# Altium schematic sheet DC_Jack_uUSB.SchDoc (part 1 of 3)
size A2; SheetNumber: 1; SheetTotal: 1
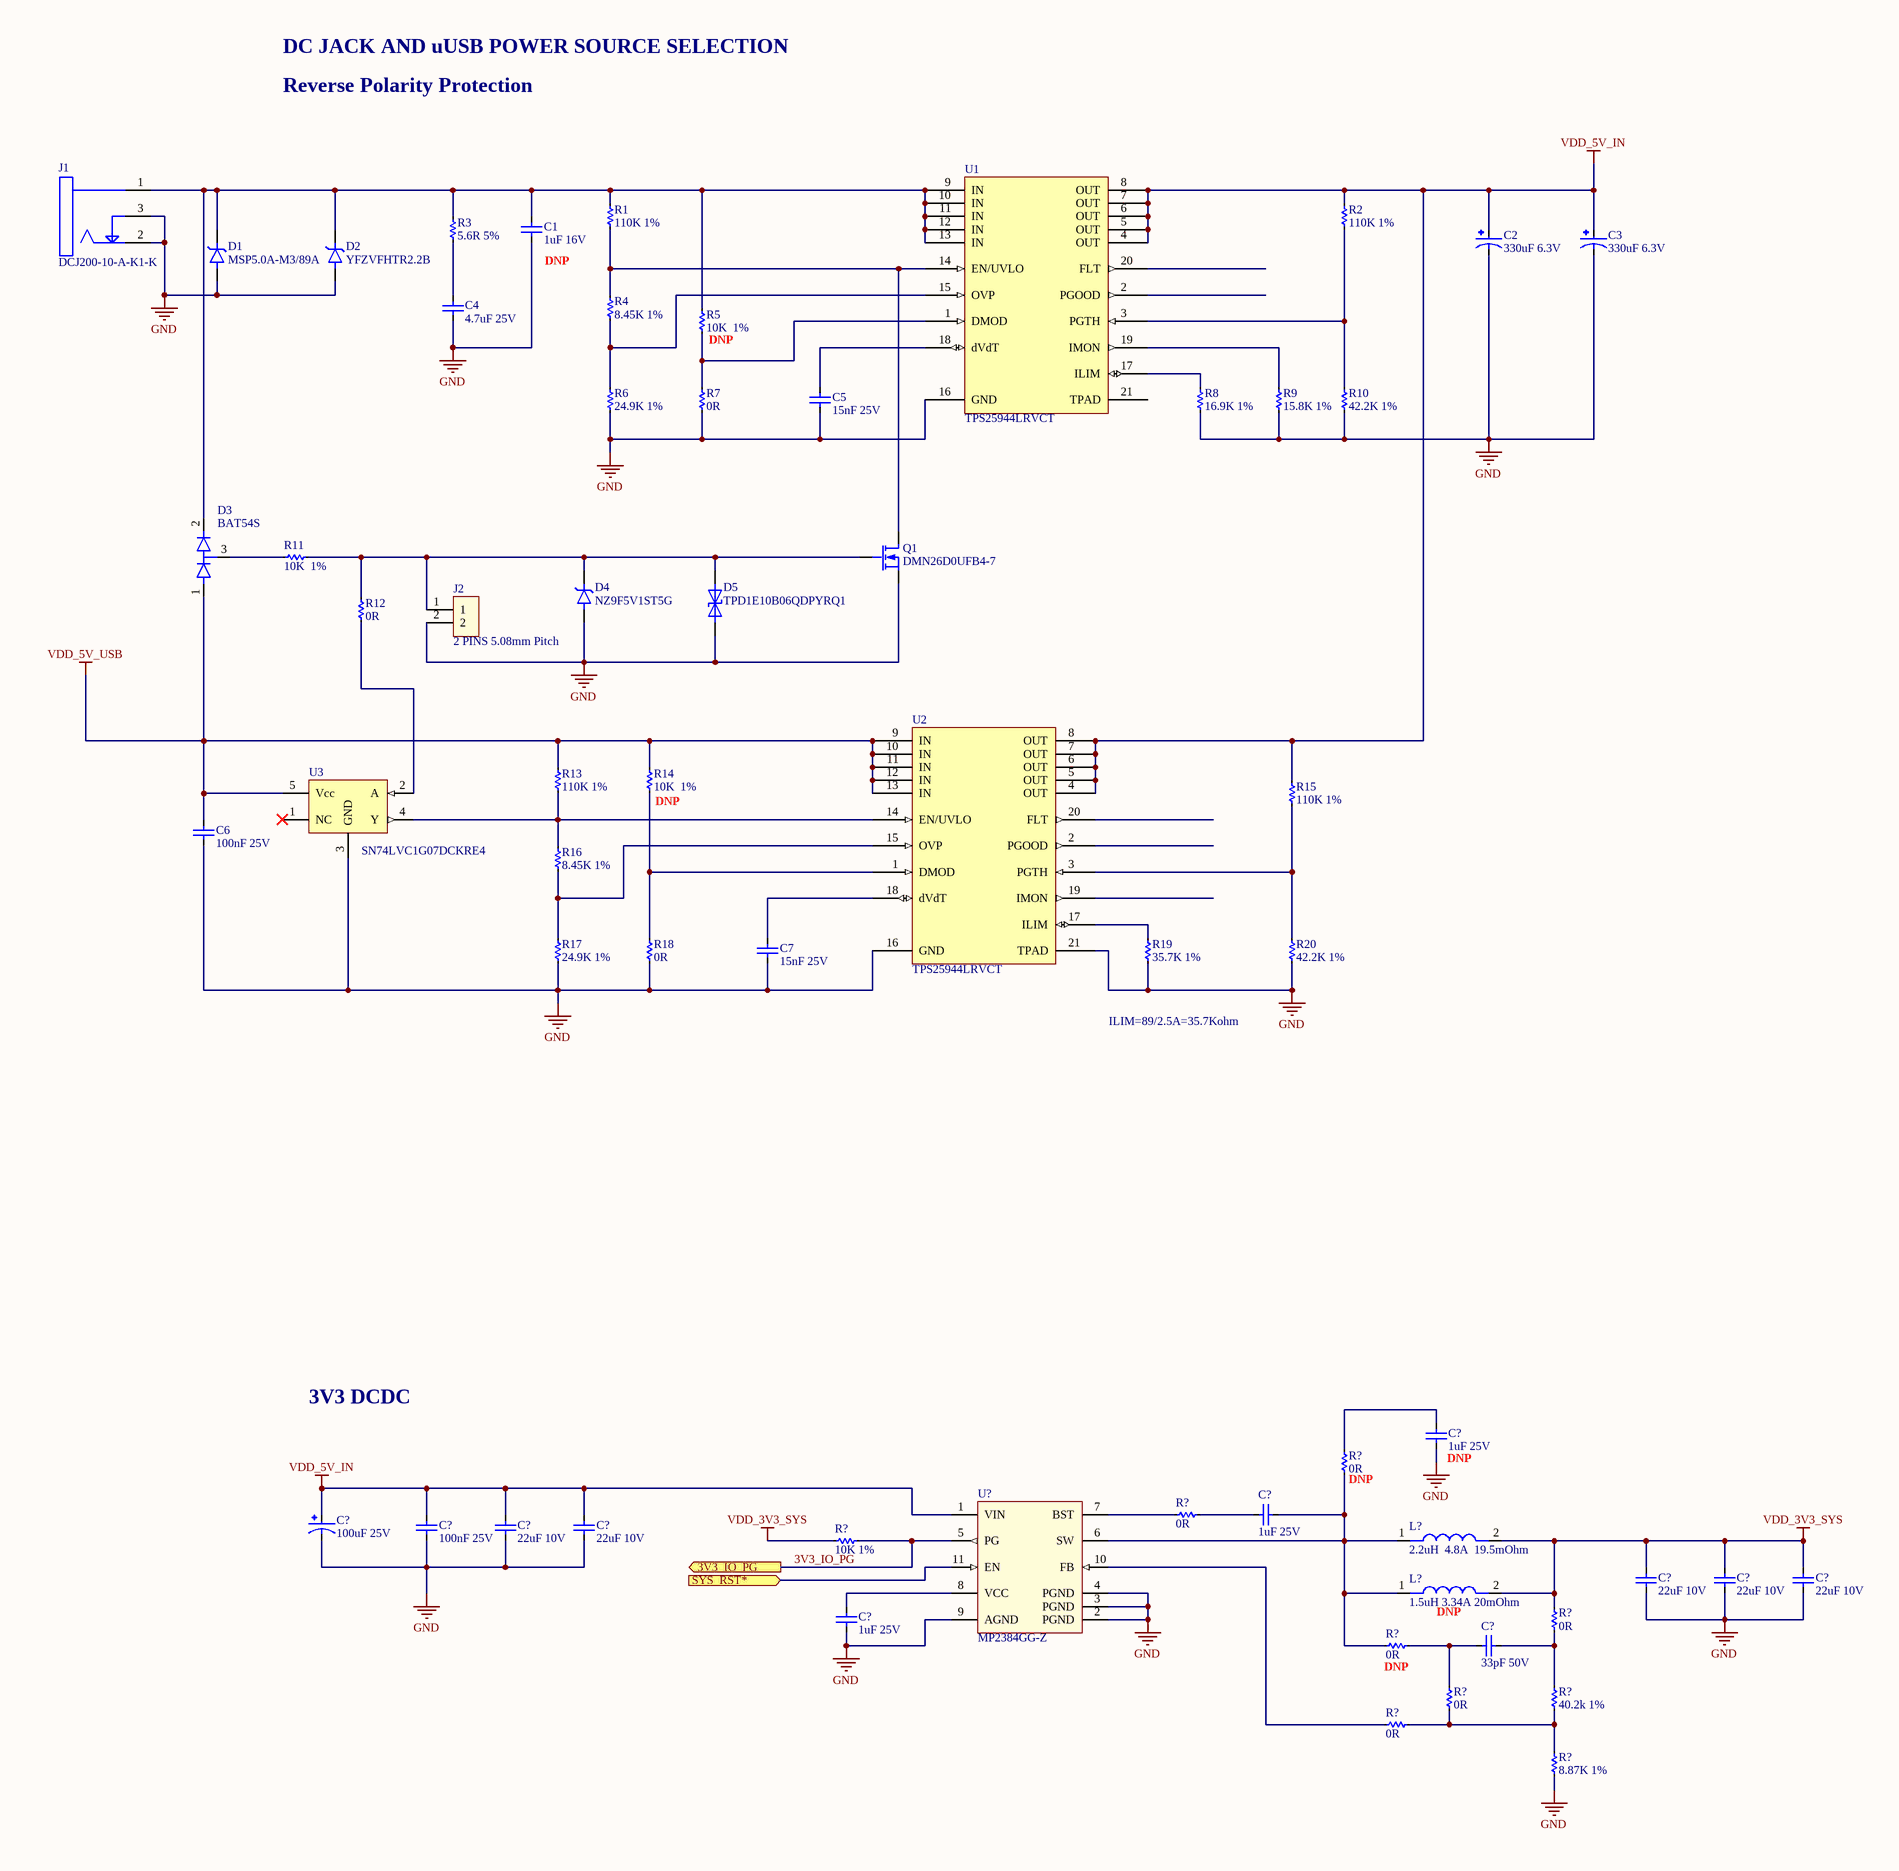
[diagram p0: DC_Jack_uUSB.SchDoc, left]
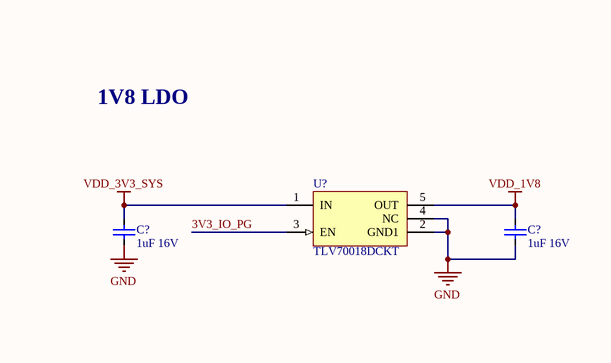
[diagram p1: DC_Jack_uUSB.SchDoc, right]

## Parts
(Parts that share a designator on the sheet are numbered #1, #2 ... from top to bottom, then left to right.)
C1  1uF 16V  [C0603]
C2  330uF 6.3V  [CP_ELEC_6.3x7.7]
C3  330uF 6.3V  [CP_ELEC_6.3x7.7]
C4  4.7uF 25V  [C0603]
C5  15nF 25V  [C0805]
C6  100nF 25V  [C0402]
C7  15nF 25V  [C0805]
C?#1  1uF 16V  [C0603]
C?#2  1uF 16V  [C0603]
C?#3  1uF 25V  [C0603]
C?#4  1uF 25V  [C0603]
C?#5  100uF 25V  [C2917_Tantalum]
C?#6  100nF 25V  [C0402]
C?#7  22uF 10V  [C0805]
C?#8  22uF 10V  [C0805]
C?#9  22uF 10V  [C0805]
C?#10  22uF 10V  [C0805]
C?#11  22uF 10V  [C0805]
C?#12  1uF 25V  [C0603]
C?#13  33pF 50V  [C0402]
D1  MSP5.0A-M3/89A  [DO-219AD]
D2  YFZVFHTR2.2B  [YFZVFHTR22B]
D3  BAT54S  [SOT23_M]
D4  NZ9F5V1ST5G  [SOD-923]
D5  TPD1E10B06QDPYRQ1  [2-X1SON (1x.60)]
J1  DCJ200-10-A-K1-K  [DCJ200-10-A-K1-K]
J2  2 PINS 5.08mm Pitch  [0395443002]
L?#1  2.2uH  4.8A  19.5mOhm  [NRS8030T2R2NJGJ]
L?#2  1.5uH 3.34A 20mOhm  [ASPI-4030S-1R5N-T]
Q1  DMN26D0UFB4-7  [DFN1006-3]
R1  110K 1%  [R0402]
R2  110K 1%  [R0402]
R3  5.6R 5%  [R0402]
R4  8.45K 1%  [R0402]
R5  10K  1%  [R0402]
R6  24.9K 1%  [R0402]
R7  0R  [R0603]
R8  16.9K 1%  [R0402]
R9  15.8K 1%  [R0603]
R10  42.2K 1%  [R0402]
R11  10K  1%  [R0402]
R12  0R  [R0603]
R13  110K 1%  [R0402]
R14  10K  1%  [R0402]
R15  110K 1%  [R0402]
R16  8.45K 1%  [R0402]
R17  24.9K 1%  [R0402]
R18  0R  [R0603]
R19  35.7K 1%  [R0402]
R20  42.2K 1%  [R0402]
R?#1  0R  [R0603]
R?#2  0R  [R0603]
R?#3  10K 1%  [R0603]
R?#4  0R  [R0603]
R?#5  0R  [R0603]
R?#6  0R  [R0603]
R?#7  40.2k 1%  [R0402]
R?#8  0R  [R0603]
R?#9  8.87K 1%  [R0402]
U1  TPS25944LRVCT  [WQFN (3x4)-20]
U2  TPS25944LRVCT  [WQFN (3x4)-20]
U3  SN74LVC1G07DCKRE4  [SC70-5]
U?#1  TLV70018DCKT  [SC70-5]
U?#2  MP2384GG-Z  [QFN(2X2)-11]

## Ports
3V3_IO_PG (out), SYS_RST* (in)

## Nets
GND: C1.1 C2.2(-) C3.2(-) C4.1 C5.1 C6.1 C7.1 C?#1.1 C?#2.1 C?#3.2 C?#5.2(-) C?#6.2 C?#7.1 C?#8.1 C?#9.1 C?#10.1 C?#11.1 C?#12.1 D1.1(A) D2.2(A) D4.2(A) D5.1 J1.2 J1.3 J2.2 Q1.2(S) R6.1 R7.1 R8.1 R9.1 R10.1 R17.1 R18.1 R19.1 R20.1 R?#9.1 U1.16(GND) U2.16(GND) U2.21(TPAD) U3.3(GND) U?#1.2(GND1) U?#1.4(NC) U?#2.2(PGND) U?#2.3(PGND) U?#2.4(PGND) U?#2.9(AGND)
VDD_1V8: C?#2.2 U?#1.5(OUT)
VDD_3V3_SYS: C?#1.2 C?#9.2 C?#10.2 C?#11.2 L?#1.2 L?#2.2 R?#3.1 R?#4.1 U?#1.1(IN)
VDD_5V_IN: C2.1(+1) C3.1(+1) C?#5.1(+1) C?#6.1 C?#7.2 C?#8.2 R2.2 R15.2 U1.4(OUT) U1.5(OUT) U1.6(OUT) U1.7(OUT) U1.8(OUT) U2.4(OUT) U2.5(OUT) U2.6(OUT) U2.7(OUT) U2.8(OUT) U?#2.1(VIN)
VDD_5V_USB: C6.2 D3.1 R13.2 R14.2 U2.9(IN) U2.10(IN) U2.11(IN) U2.12(IN) U2.13(IN) U3.5(Vcc)
3V3_IO_PG: R?#3.2 U?#1.3(EN) U?#2.5(PG) ; port 3V3_IO_PG
SYS_RST*: U?#2.11(EN) ; port SYS_RST*
NetC1_2: C1.2 D1.2(C) D2.1(K) D3.2 J1.1 R1.2 R3.2 R5.2 U1.9(IN) U1.10(IN) U1.11(IN) U1.12(IN) U1.13(IN)
NetC4_2: C4.2 R3.1
NetC5_2: C5.2 U1.18(dVdT)
NetC7_2: C7.2 U2.18(dVdT)
NetC?#3_1: C?#3.1 R?#1.1
NetC?#4_1: C?#4.1 R?#2.1
NetC?#4_2: C?#4.2 L?#1.1 L?#2.1 R?#1.2 R?#5.2 U?#2.6(SW)
NetC?#12_2: C?#12.2 U?#2.8(VCC)
NetC?#13_1: C?#13.1 R?#5.1 R?#6.1
NetC?#13_2: C?#13.2 R?#4.2 R?#7.2
NetD3_3: D3.3 R11.2
NetD4_1: D4.1(K) D5.2 J2.1 Q1.1(G) R11.1 R12.2
NetQ1_3: Q1.3(D) R1.1 R4.2 U1.14(EN/UVLO)
NetR2_1: R2.1 R10.2 U1.3(PGTH)
NetR4_1: R4.1 R6.2 U1.15(OVP)
NetR5_1: R5.1 R7.2 U1.1(DMOD)
NetR8_2: R8.2 U1.17(ILIM)
NetR9_2: R9.2 U1.19(IMON)
NetR12_1: R12.1 U3.2(A)
NetR13_1: R13.1 R16.2 U2.14(EN/UVLO) U3.4(Y)
NetR14_1: R14.1 R18.2 U2.1(DMOD)
NetR15_1: R15.1 R20.2 U2.3(PGTH)
NetR16_1: R16.1 R17.2 U2.15(OVP)
NetR19_2: R19.2 U2.17(ILIM)
NetR?#2_2: R?#2.2 U?#2.7(BST)
NetR?#6_2: R?#6.2 R?#7.1 R?#8.2 R?#9.2
NetR?#8_1: R?#8.1 U?#2.10(FB)

Not connected (* = marked no-connect by the designer): U1 2(PGOOD) 20(FLT) 21(TPAD); U2 2(PGOOD) 19(IMON) 20(FLT); U3 1(NC)*

## Notes on the sheet
- DC JACK AND uUSB POWER SOURCE SELECTION
- Reverse Polarity Protection
- (near C1) DNP
- 1V8 LDO
- (near R5) DNP
- (near R14) DNP
- ILIM=89/2.5A=35.7Kohm
- 3V3 DCDC
- (near R?#1) DNP
- (near C?#3) DNP
- (near L?#2) DNP
- (near R?#5) DNP